# EAGLE design Breakout_V399 (EAGLE 8.3.2)
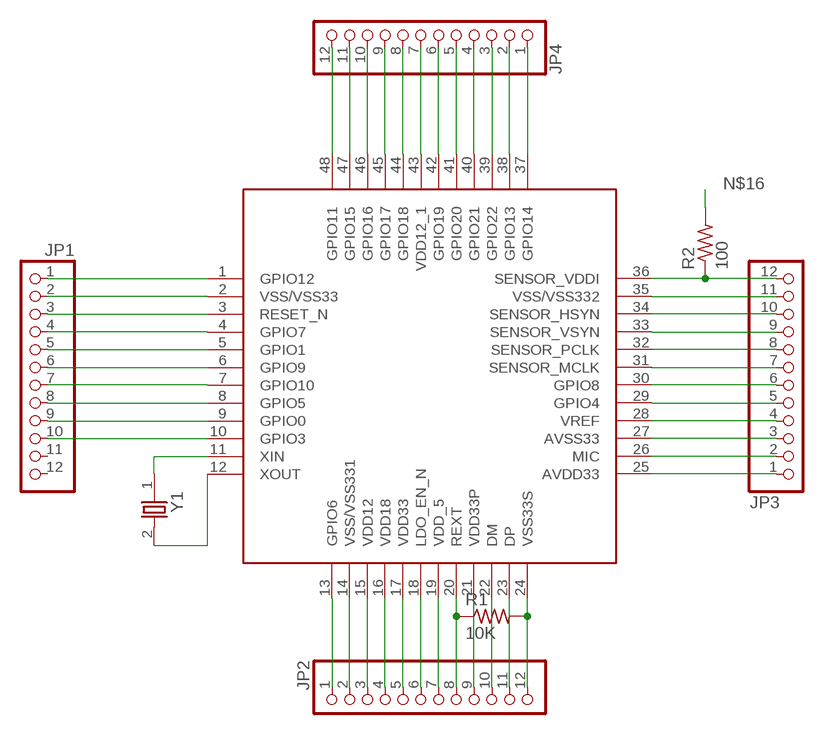
[diagram p0: schematic, sheet 1]

## Parts
JP1  PINHD-1X12-CB  [1X12-CB]
JP2  PINHD-1X12-CB  [1X12-CB]
JP3  PINHD-1X12-CB  [1X12-CB]
JP4  PINHD-1X12-CB  [1X12-CB]
R1  10K  R-US_R0402  [R0402]
R2  100  R-US_R0402  [R0402]
U1  V399  [LQFP48]
Y1  ABM3-29.4912MHZ-B2-T  [XTAL500X320X130N]

## Nets
N$1: JP1.1 U1.1(GPIO12)
N$2: JP1.2 U1.2(VSS/VSS33)
N$3: JP1.3 U1.3(RESET_N)
N$4: JP1.4 U1.4(GPIO7)
N$5: JP1.5 U1.5(GPIO1)
N$6: JP1.6 U1.6(GPIO9)
N$7: JP1.7 U1.7(GPIO10)
N$8: JP1.8 U1.8(GPIO5)
N$9: JP1.9 U1.9(GPIO0)
N$10: JP1.10 U1.10(GPIO3)
N$12: JP2.1 U1.13(GPIO6)
N$13: JP2.2 U1.14(VSS/VSS331)
N$14: JP2.3 U1.15(VDD12)
N$15: JP2.4 U1.16(VDD18)
N$16: JP2.5 R2.2 U1.17(VDD33)
N$17: JP2.6 U1.18(LDO_EN_N)
N$18: JP2.7 U1.19(VDD_5)
N$19: JP2.8 R1.1 U1.20(REXT)
N$20: JP2.9 U1.21(VDD33P)
N$21: JP2.10 U1.22(DM)
N$22: JP2.11 U1.23(DP)
N$23: JP2.12 R1.2 U1.24(VSS33S)
N$24: JP3.1 U1.25(AVDD33)
N$25: JP3.2 U1.26(MIC)
N$26: JP3.3 U1.27(AVSS33)
N$27: JP3.4 U1.28(VREF)
N$28: JP3.5 U1.29(GPIO4)
N$29: JP3.6 U1.30(GPIO8)
N$30: JP3.7 U1.31(SENSOR_MCLK)
N$31: JP3.8 U1.32(SENSOR_PCLK)
N$32: JP3.9 U1.33(SENSOR_VSYN)
N$33: JP3.10 U1.34(SENSOR_HSYN)
N$34: JP3.11 U1.35(VSS/VSS332)
N$35: JP3.12 R2.1 U1.36(SENSOR_VDDI)
N$36: JP4.12 U1.48(GPIO11)
N$37: JP4.11 U1.47(GPIO15)
N$38: JP4.1 U1.37(GPIO14)
N$39: JP4.2 U1.38(GPIO13)
N$40: JP4.3 U1.39(GPIO22)
N$41: JP4.4 U1.40(GPIO21)
N$42: JP4.5 U1.41(GPIO20)
N$43: JP4.6 U1.42(GPIO19)
N$44: JP4.7 U1.43(VDD12_1)
N$45: JP4.8 U1.44(GPIO18)
N$46: JP4.9 U1.45(GPIO17)
N$47: JP4.10 U1.46(GPIO16)
N$48: U1.11(XIN) Y1.1
N$49: U1.12(XOUT) Y1.2
Unconnected: JP1.11 JP1.12

## Library data of the parts
JP1-JP4 = adafruit:PINHD-1X12: PIN HEADER
R1 R2 = rcl:R-US_: RESISTOR, American symbol
U1 = v399:V399
Y1 = ABM3-29.4912MHZ-B2-T:ABM3-29.4912MHZ-B2-T: Crystals 12MHz 18pF 30ppm -40C +85C; AVAILABILITY: Good; DESCRIPTION: CRYSTAL 29.4912MHZ 18PF SMD; MF: Abracon; MP: ABM3-29.4912MHZ-B2-T; PACKAGE: SMD-2 Abracon; PRICE: 0.49 USD

## Board
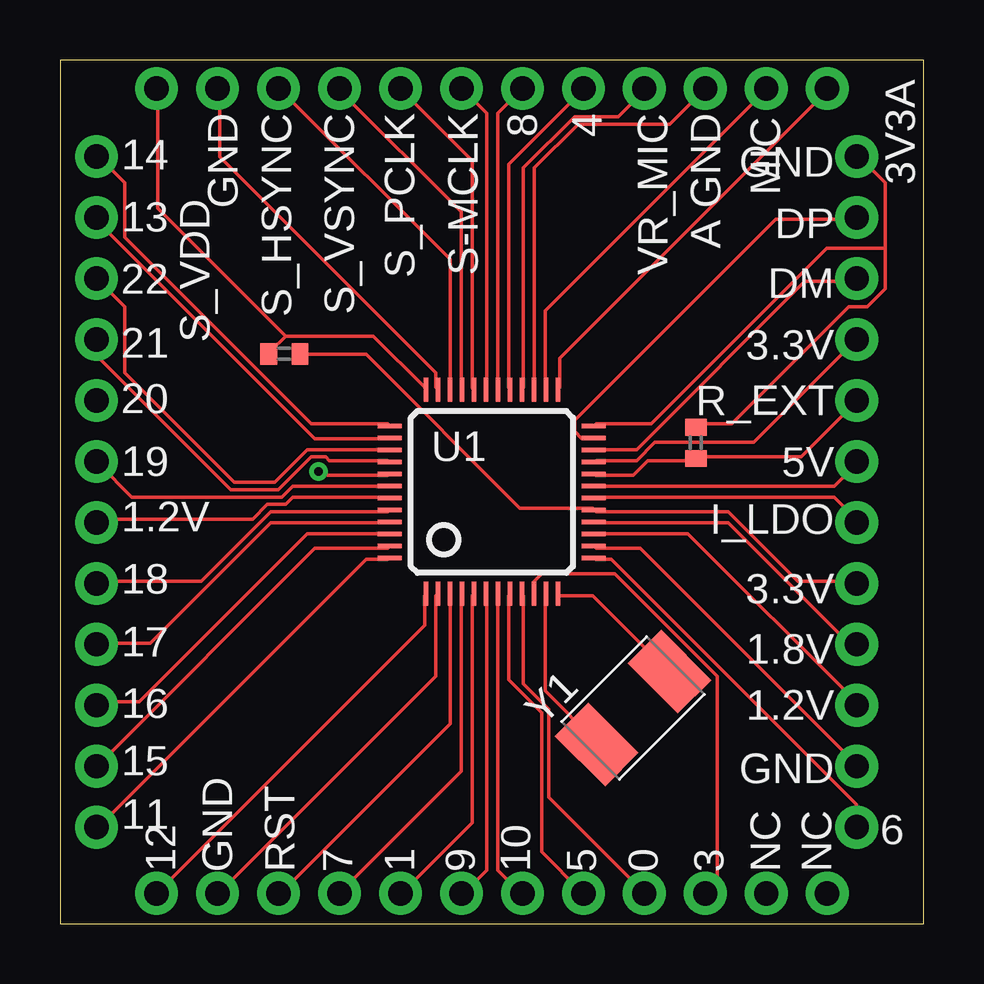
[diagram p1: board, top side]
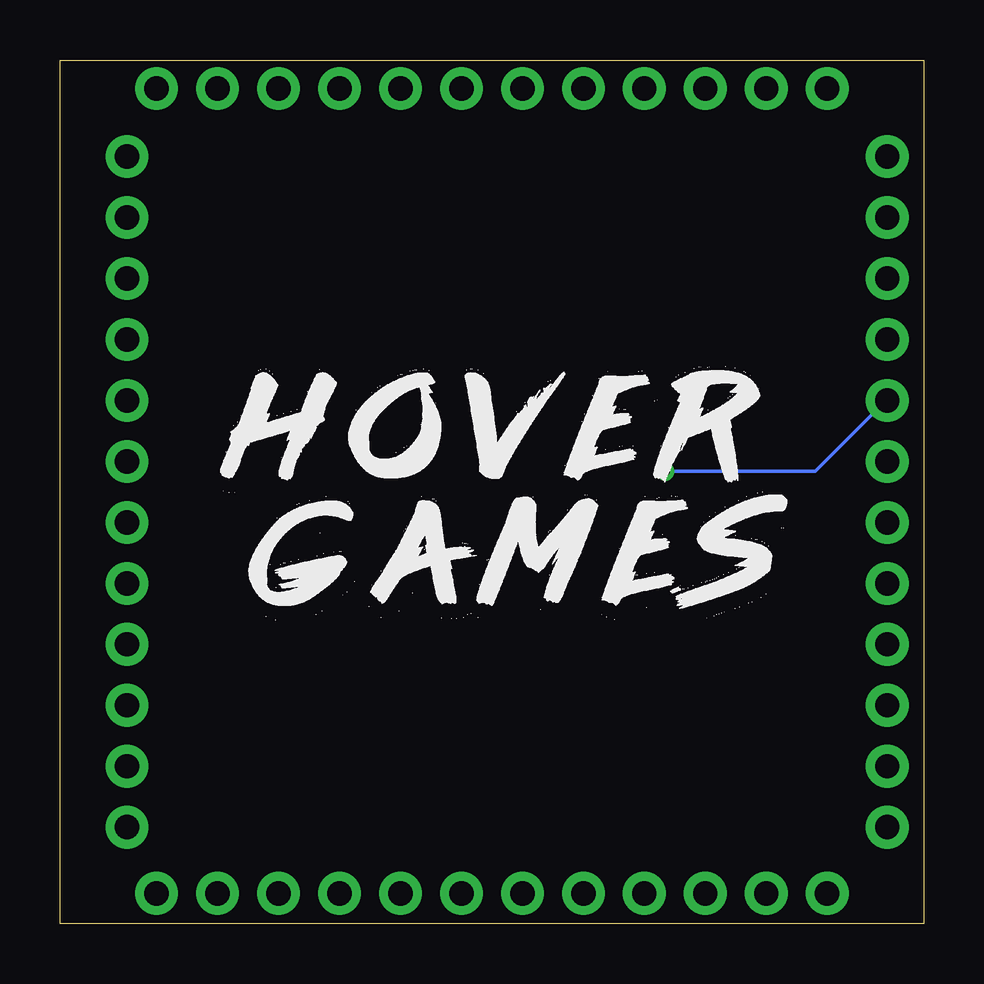
[diagram p2: board, bottom side, seen from below]

Size 35.99 x 35.99 mm. Coordinates in mm from the lower left corner, seen from the top.
Outline: 0,0 35.99,0 35.99,35.99 0,35.99 0,0
Copper layers (1*16): Top 0.035mm / dielectric 1.5mm / Bottom 0.035mm
Design rules "default": minimum track width 6mil, minimum drill 0.35mm, track to track 6mil, track to pad 6mil, pad to pad 6mil, via to via 6mil, smd to smd 6mil, copper to edge 40mil, drill to drill 6mil, minimum pad ring 10mil, minimum via ring 8mil, stop-mask expansion 4mil, vias tented up to drill 0mil, thermal gap 10mil

### Footprints (pad centres in the part's own frame; a part is rotated, then mirrored left to right if it is on the bottom)
1X12-CB = drill 1.016 pad 1.778: 1 -13.97,0; 2 -11.43,0; 3 -8.89,0; 4 -6.35,0; 5 -3.81,0; 6 -1.27,0; 7 1.27,0; 8 3.81,0; 9 6.35,0; 10 8.89,0; 11 11.43,0; 12 13.97,0
R0402 = smd 0.7 x 0.9: 1 -0.65,0; 2 0.65,0
LQFP48 = smd 0.2 x 1: 1 -2.75,-4.25; 2 -2.25,-4.25; 3 -1.75,-4.25; 4 -1.25,-4.25; 5 -0.75,-4.25; 6 -0.25,-4.25; 7 0.25,-4.25; 8 0.75,-4.25; 9 1.25,-4.25; 10 1.75,-4.25; 11 2.25,-4.25; 12 2.75,-4.25; 25 2.75,4.25; 26 2.25,4.25; 27 1.75,4.25; 28 1.25,4.25; 29 0.75,4.25; 30 0.25,4.25; 31 -0.25,4.25; 32 -0.75,4.25; 33 -1.25,4.25; 34 -1.75,4.25; 35 -2.25,4.25; 36 -2.75,4.25 | smd 1 x 0.2: 13 4.25,-2.75; 14 4.25,-2.25; 15 4.25,-1.75; 16 4.25,-1.25; 17 4.25,-0.75; 18 4.25,-0.25; 19 4.25,0.25; 20 4.25,0.75; 21 4.25,1.25; 22 4.25,1.75; 23 4.25,2.25; 24 4.25,2.75; 37 -4.25,2.75; 38 -4.25,2.25; 39 -4.25,1.75; 40 -4.25,1.25; 41 -4.25,0.75; 42 -4.25,0.25; 43 -4.25,-0.25; 44 -4.25,-0.75; 45 -4.25,-1.25; 46 -4.25,-1.75; 47 -4.25,-2.25; 48 -4.25,-2.75
XTAL500X320X130N = smd 1.95 x 2.95: 1 -2.15,0; 2 2.15,0

### Placement (x,y rotation side)
JP1  18,1.27 0 top
JP2  33.2,18 90 top
JP3  18,34.8 180 top
JP4  1.52,18 270 top
R1  26.49,20.04 90 top
R2  9.35,23.75 0 top
U1  18,18 0 top
Y1  23.88,8.99 45 top

### Tracks (layer width: path | path; a pad name or v marks a point on that pad's centre or on a via)
N$1
  Top 0.152: U1.1 15.19,13.67 15.19,12.45 4.06,1.32 JP1.1
N$2
  Top 0.152: U1.2 15.65,13.67 15.65,10.31 6.65,1.32 JP1.2
N$3
  Top 0.152: U1.3 16.26,13.67 16.26,8.33 9.25,1.32 JP1.3
N$4
  Top 0.152: U1.4 16.71,13.67 16.71,6.35 11.68,1.32 JP1.4
N$5
  Top 0.152: U1.5 17.17,13.67 17.17,4.22 14.27,1.32 JP1.5
N$6
  Top 0.152: U1.6 17.78,13.67 17.78,2.23 16.87,1.32 JP1.6
N$7
  Top 0.152: U1.7 18.24,13.67 18.24,2.23 19.15,1.32 JP1.7
N$8
  Top 0.152: U1.8 18.69,13.67 18.69,10.16 20.07,8.79 20.07,3 21.74,1.32 JP1.8
N$9
  Top 0.152: U1.9 19.3,13.67 19.3,10.01 20.37,8.94 20.37,5.28 24.33,1.32 JP1.9
N$10
  Top 0.152: U1.10 19.76,13.82 19.76,14.28 20.07,14.58 23.11,14.58 27.38,10.31 27.38,1.78 26.92,1.32 JP1.10
N$12
  Top 0.152: U1.13 22.35,15.19 22.96,15.19 33.17,4.98 33.17,4.06 JP2.1
N$13
  Top 0.152: U1.14 22.35,15.65 24.18,15.65 33.17,6.65 JP2.2
N$14
  Top 0.152: U1.15 22.35,16.26 26.16,16.26 33.17,9.25 JP2.3
N$15
  Top 0.152: U1.16 22.35,16.71 27.84,16.71 32.87,11.68 33.17,11.68 JP2.4
N$16
  Top 0.152: R2.2 10.01,23.72 12.75,23.72 19.15,17.32 22.2,17.32 U1.17 22.35,17.17 27.84,17.17 30.73,14.28 33.17,14.28 JP2.5
N$17
  Top 0.152: U1.18 22.35,17.78 32.26,17.78 33.17,16.87 JP2.6
N$18
  Top 0.152: U1.19 22.35,18.24 32.26,18.24 33.17,19.15 JP2.7
N$19
  Top 0.152: U1.20 22.35,18.69 23.88,18.69 24.49,19.3 26.47,19.3 R1.1 26.62,19.46 30.89,19.46 33.17,21.74 JP2.8
N$20
  Top 0.152: U1.21 22.35,19.3 24.03,19.3 24.79,20.07 28.9,20.07 33.17,24.33 JP2.9
N$21
  Top 0.152: U1.22 22.35,19.76 24.03,19.76 31.04,26.77 33.17,26.77 JP2.10
N$22
  Top 0.152: U1.23 22.2,20.22 21.74,20.22 21.44,20.52 21.44,20.98 29.82,29.36 33.17,29.36 JP2.11
N$23
  Top 0.152: 34.39,28.14 34.39,30.89 33.33,31.95 JP2.12 | 34.39,28.14 34.39,26.47 33.63,25.71 32.87,25.71 27.99,20.83 26.62,20.83 R1.2 | 34.39,28.14 31.95,28.14 24.64,20.83 22.35,20.83 U1.24
N$24
  Top 0.152: U1.25 20.83,22.35 20.83,23.57 31.95,34.7 JP3.1
N$25
  Top 0.152: U1.26 20.22,22.35 20.22,25.55 29.36,34.7 JP3.2
N$26
  Top 0.152: U1.27 19.76,22.35 19.76,31.5 21.59,33.33 25.4,33.33 26.77,34.7 JP3.3
N$27
  Top 0.152: U1.28 19.3,22.35 19.3,31.5 21.44,33.63 23.27,33.63 24.33,34.7 JP3.4
N$28
  Top 0.152: U1.29 18.69,22.35 18.69,31.65 21.74,34.7 JP3.5
N$29
  Top 0.152: U1.30 18.24,22.35 18.24,33.78 19.15,34.7 JP3.6
N$30
  Top 0.152: U1.31 17.78,22.35 17.78,33.78 16.87,34.7 JP3.7
N$31
  Top 0.152: U1.32 17.17,22.35 17.17,31.8 14.27,34.7 JP3.8
N$32
  Top 0.152: U1.33 16.71,22.35 16.71,29.67 11.68,34.7 JP3.9
N$33
  Top 0.152: U1.34 16.26,22.35 16.26,27.69 9.25,34.7 JP3.10
N$34
  Top 0.152: U1.35 15.65,22.35 15.65,22.96 6.65,31.95 6.65,34.7 JP3.11
N$35
  Top 0.152: 9.4,24.49 8.79,23.88 R2.1 | 9.4,24.49 13.06,24.49 15.19,22.35 U1.36 | 9.4,24.49 4.06,29.82 4.06,34.7 JP3.12
N$36
  Top 0.152: U1.48 13.66,15.19 12.75,15.19 1.63,4.06 JP4.12
N$37
  Top 0.152: U1.47 13.66,15.65 10.62,15.65 1.63,6.65 JP4.11
N$38
  Top 0.152: U1.37 13.66,20.83 10.46,20.83 2.69,28.6 2.69,30.89 1.63,31.95 JP4.1
N$39
  Top 0.152: U1.38 13.66,20.22 10.62,20.22 1.47,29.36 JP4.2
N$40
  Top 0.152: U1.39 13.66,19.76 10.31,19.76 8.94,18.39 7.26,18.39 2.69,22.96 2.69,25.71 1.63,26.77 JP4.3
N$41
  Top 0.152: U1.40 13.66,19.3 11.23,19.3 11.07,19.46 10.46,19.46 9.09,18.08 7.11,18.08 1.63,23.57 1.63,24.33 JP4.4
N$42  (via drill 0.35)
  Top 0.152: v10.77,18.85 10.92,18.69 13.66,18.69 U1.41
  Bottom 0.152: v10.77,18.85 4.52,18.85 1.63,21.74 JP4.5
N$43
  Top 0.152: U1.42 13.66,18.24 9.7,18.24 9.25,17.78 3,17.78 1.63,19.15 JP4.6
N$44
  Top 0.152: U1.43 13.66,17.78 9.7,17.78 9.4,17.47 8.64,17.47 8.03,16.87 1.63,16.87 JP4.7
N$45
  Top 0.152: U1.44 13.66,17.17 8.79,17.17 5.89,14.28 1.63,14.28 JP4.8
N$46
  Top 0.152: U1.45 13.66,16.71 8.79,16.71 3.76,11.68 1.63,11.68 JP4.9
N$47
  Top 0.152: U1.46 13.66,16.26 10.31,16.26 3.3,9.25 1.63,9.25 JP4.10
N$48
  Top 0.152: U1.11 20.22,13.67 20.22,9.7 22.35,7.57 Y1.1
N$49
  Top 0.152: U1.12 20.83,13.67 22.2,13.67 25.25,10.62 Y1.2

### Text on the board
tNames: 3V3A | GND | S_HSYNC | S_VSYNC | S_PCLK | S-MCLK | 8 | 4 | VR_MIC | A GND | MIC | GND | 14 | S_VDD | DP | 13 | DM | 22 | 3.3V | 21 | R_EXT | 20 | 5V | 19 | I_LDO | 1.2V | 3.3V | 18 | 1.8V | 17 | 1.2V | 16 | GND | 15 | 6 | 11 | 12 | GND | RST | 7 | 1 | 9 | 10 | 5 | 0 | 3 | NC | NC